# EAGLE design video (EAGLE 7.1.0)
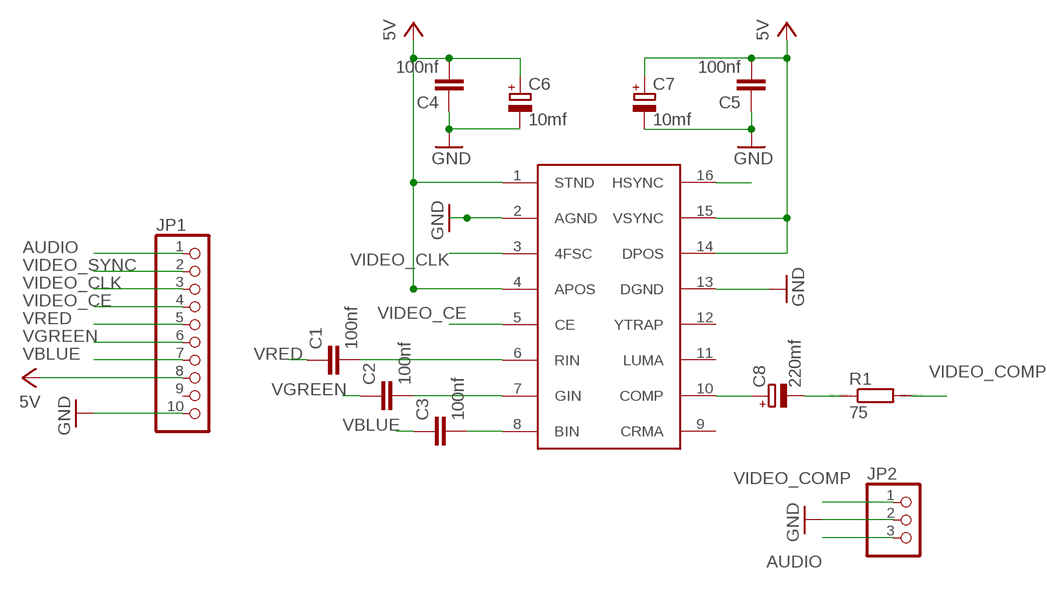
[diagram p0: schematic, sheet 1]

## Parts
C1  100nf  C-EUC0805  [C0805]
C2  100nf  C-EUC0805  [C0805]
C3  100nf  C-EUC0805  [C0805]
C4  100nf  C-EUC0805  [C0805]
C5  100nf  C-EUC0805  [C0805]
C6  10mf  CPOL-EUE1.8-4  [E1,8-4]
C7  10mf  CPOL-EUE1.8-4  [E1,8-4]
C8  220mf  CPOL-EUE1.8-4  [E1,8-4]
JP1  PINHD-1X10  [1X10]
JP2  PINHD-1X3  [1X03]
R1  75  R-EU_R0805  [R0805]
U$1  AD725  [SO16W]

## Nets
AUDIO: JP1.1 JP2.3
GND: C4.1 C5.1 C6.- C7.- JP1.10 JP2.2 U$1.2(AGND) U$1.13(DGND)
N$1: C1.2 U$1.6(RIN)
N$2: C2.2 U$1.7(GIN)
N$3: C3.2 U$1.8(BIN)
N$4: C8.+ U$1.10(COMP)
N$5: C8.- R1.1
VBLUE: C3.1 JP1.7
VCC: C4.2 C5.2 C6.+ C7.+ JP1.8 U$1.1(STND) U$1.4(APOS) U$1.14(DPOS) U$1.15(VSYNC) ; supply symbol labelled 5V
VGREEN: C2.1 JP1.6
VIDEO_CE: JP1.4 U$1.5(CE)
VIDEO_CLK: JP1.3 U$1.3(4FSC)
VIDEO_COMP: JP2.1 R1.2
VIDEO_SYNC: JP1.2 U$1.16(HSYNC)
VRED: C1.1 JP1.5
Unconnected: JP1.9 U$1.9(CRMA) U$1.11(LUMA) U$1.12(YTRAP)

## Library data of the parts
C1-C5 = rcl:C-EU: CAPACITOR, European symbol
C6-C8 = rcl:CPOL-EU: POLARIZED CAPACITOR, European symbol
JP1 = pinhead:PINHD-1X10: PIN HEADER
JP2 = pinhead:PINHD-1X3: PIN HEADER
R1 = resistor:R-EU_: RESISTOR, European symbol; SPICEPREFIX: R
U$1 = ad725:AD725

## Board
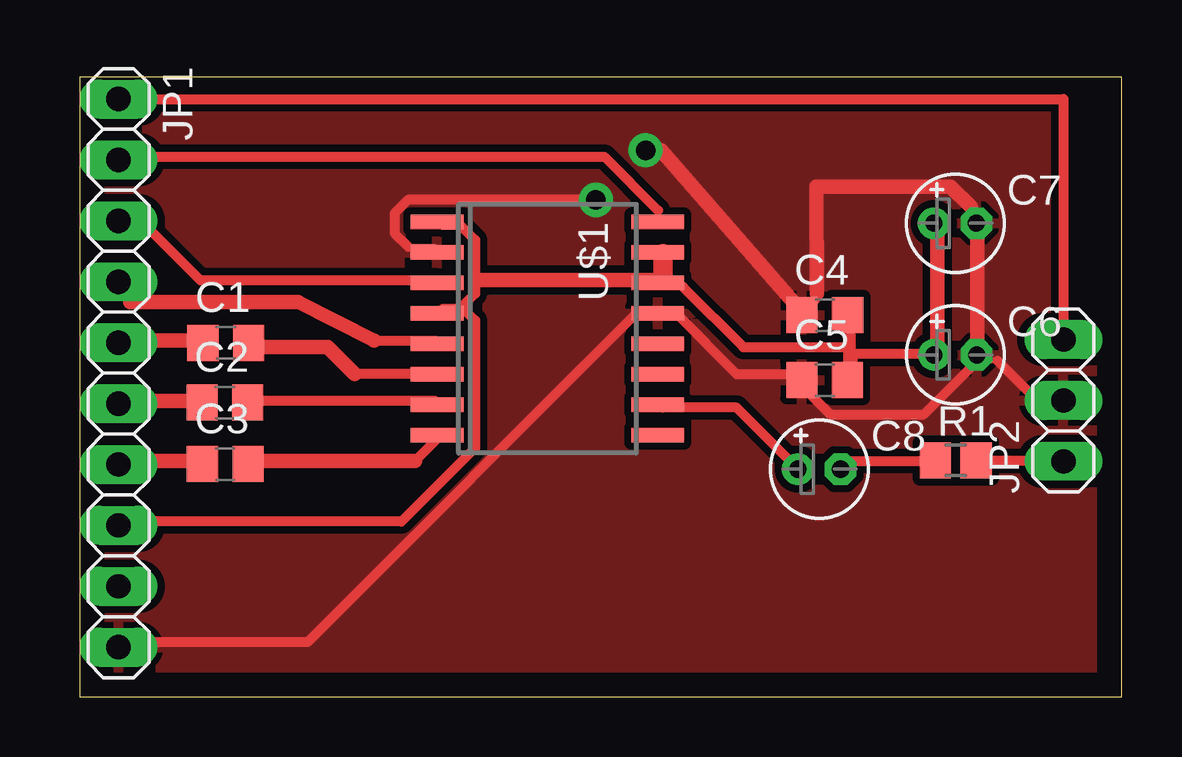
[diagram p1: board, top side]
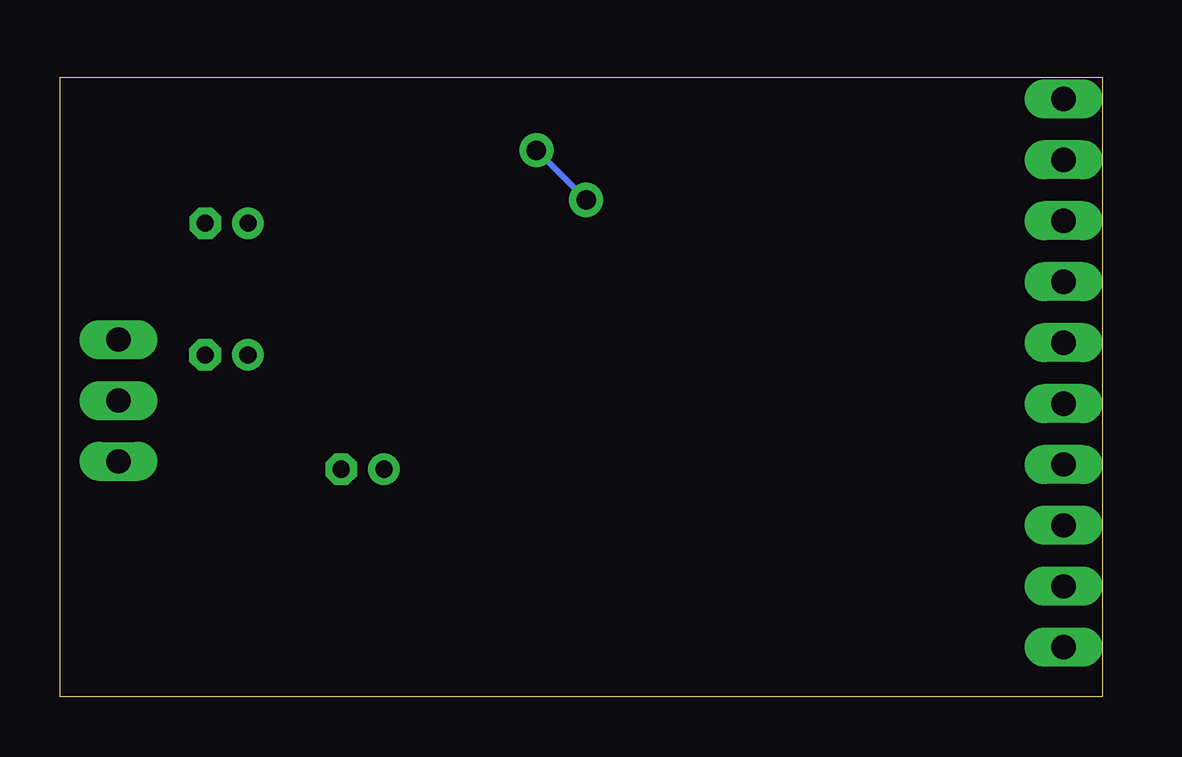
[diagram p2: board, bottom side, seen from below]

Size 43.44 x 25.84 mm. Coordinates in mm from the lower left corner, seen from the top.
Outline: 0,0 43.44,0 43.44,25.84 0,25.84 0,0
Copper layers (1*16): Top 0.035mm / dielectric 1.5mm / Bottom 0.035mm
Design rules "default *": minimum track width 10mil, minimum drill 32mil, track to track 12mil, track to pad 12mil, pad to pad 8mil, via to via 12mil, smd to smd 8mil, copper to edge 40mil, drill to drill 40mil, minimum pad ring 12mil, minimum via ring 12mil, stop-mask expansion 4mil, vias tented up to drill 0mil, thermal gap 10mil

### Footprints (pad centres in the part's own frame; a part is rotated, then mirrored left to right if it is on the bottom)
C0805 = smd 1.3 x 1.5: 1 -0.95,0; 2 0.95,0
E1,8-4 = drill 0.711 pad 1.168: + -0.889,0 | drill 0.711 pad 1.168 octagon: - 0.889,0
1X10 = drill 1.016 long: 1 -11.43,0; 2 -8.89,0; 3 -6.35,0; 4 -3.81,0; 5 -1.27,0; 6 1.27,0; 7 3.81,0; 8 6.35,0; 9 8.89,0; 10 11.43,0
1X03 = drill 1.016 long: 1 -2.54,0; 2 0,0; 3 2.54,0
R0805 = smd 1.3 x 1.5: 1 -0.85,0; 2 0.85,0
SO16W = smd 0.6 x 2.2: 1 -4.445,-4.6; 2 -3.175,-4.6; 3 -1.905,-4.6; 4 -0.635,-4.6; 5 0.635,-4.6; 6 1.905,-4.6; 7 3.175,-4.6; 8 4.445,-4.6; 9 4.445,4.6; 10 3.175,4.6; 11 1.905,4.6; 12 0.635,4.6; 13 -0.635,4.6; 14 -1.905,4.6; 15 -3.175,4.6; 16 -4.445,4.6

### Placement (x,y rotation side)
C1  6.09,14.76 0 top
C2  6.05,12.27 0 top
C3  6.07,9.71 0 top
C4  31.06,15.91 0 top
C5  31.05,13.21 0 top
C6  36.5,14.26 0 top
C7  36.49,19.75 0 top
C8  30.83,9.49 0 top
JP1  1.62,13.5 270 top
JP2  41,12.36 90 top
R1  36.51,9.86 0 top
U$1  19.49,15.35 270 top

### Tracks (layer width: path | path; a pad name or v marks a point on that pad's centre or on a via)
AUDIO
  Top 0.406: JP1.1 41,24.93 JP2.3
GND  (via drill 0.81)
  Top 0.254: 38.25,14.02 37.42,14.02 C6.- | 39.65,12.62 40.77,12.62 JP2.2 | 30.73,16.81 30.73,16.53 30.18,15.97 C4.1 | 37.14,20.44 37.14,19.89 C7.- 37.42,19.61 | 13.69,18.77 14.81,18.77 U$1.2 | 24.22,22.79 v23.58,22.79 | 37.42,14.3 C6.- | 24.87,15.97 24.31,15.97 U$1.13 24.03,15.97 23.19,15.97 | 29.9,13.46 C5.1 29.9,13.18 | 1.68,2.28 JP1.10 | 37.14,13.74 37.14,14.02 C6.-
  Top 0.406: 39.65,12.62 38.25,14.02 | 13.69,18.77 13.13,19.33 13.13,20.16 13.69,20.72 v21.51,20.72 | 29.9,13.46 27.38,13.46 24.87,15.97 | 1.68,2.28 9.5,2.28 23.19,15.97 | 37.14,13.74 35.18,11.78 31.29,11.78 29.9,13.18
  Top 0.61: 30.73,16.81 30.71,21.28 36.3,21.28 37.14,20.44 | 30.18,15.97 24.22,22.79 | 37.42,19.61 37.42,14.3
  Bottom 0.254: v23.58,22.79 v21.51,20.72
  pour Top: 43.25,25.71 0.04,25.71 0.04,0 43.29,0 43.29,25.71
N$1
  Top 0.254: 7.26,14.58 C1.2 | 14.81,13.46 U$1.6
  Top 0.406: 14.81,13.46 11.46,13.46
  Top 0.61: 7.26,14.58 10.34,14.58 11.46,13.46
N$2
  Top 0.254: 7.26,12.34 C2.2 | 14.81,12.34 U$1.7
  Top 0.406: 14.81,12.34 7.26,12.34
N$3
  Top 0.254: 7.26,9.83 C3.2 | 14.81,10.67 U$1.8
  Top 0.406: 14.81,10.67 13.97,9.83
  Top 0.61: 13.97,9.83 7.26,9.83
N$4
  Top 0.254: 24.31,12.06 U$1.10 | 29.9,9.55 C8.+
  Top 0.406: 24.31,12.06 27.38,12.06 29.9,9.55
N$5
  Top 0.254: 32.13,9.83 31.85,9.55 C8.- | 35.46,9.83 R1.1
  Top 0.406: 32.13,9.83 35.46,9.83
VBLUE
  Top 0.254: 5.03,9.83 C3.1 | 1.68,9.83 JP1.7
  Top 0.61: 1.68,9.83 5.03,9.83
VCC
  Top 0.254: 32.13,14.58 32.13,14.3 | 32.13,13.46 C5.2 | 32.13,15.69 C4.2 | 35.46,14.3 C6.+ 35.74,14.3 | 35.74,19.61 C7.+ | 24.31,17.37 U$1.14 | 24.31,18.49 U$1.15 | 15.93,19.61 15.09,19.61 U$1.1 | 24.03,17.37 U$1.14 | 1.68,7.31 JP1.8 | 25.15,17.09 24.31,17.09 U$1.14 | 15.93,16.25 15.09,16.25 U$1.4 15.93,16.25
  Top 0.406: 32.13,15.69 32.13,14.58 27.66,14.58 25.15,17.09 | 35.46,14.3 32.13,14.3 | 15.93,19.61 16.48,19.05 16.48,17.37 16.48,16.81 15.93,16.25 16.48,15.69 16.48,10.39 13.41,7.31 1.68,7.31
  Top 0.61: 32.13,14.3 32.13,13.46 | 35.74,14.3 35.74,19.61 | 16.48,17.37 24.03,17.37
  Top 0.813: 24.31,18.49 24.31,17.37
VGREEN
  Top 0.254: 5.03,12.34 C2.1 | 1.68,12.34 JP1.6
  Top 0.61: 1.68,12.34 5.03,12.34
VIDEO_CE
  Top 0.254: 2.11,16.46 1.68,17.09 JP1.4 | 14.81,14.86 U$1.5
  Top 0.406: 12.28,14.86 14.81,14.86
  Top 0.61: 12.28,14.86 9.1,16.46 2.11,16.46
VIDEO_CLK
  Top 0.254: 2.79,19.61 1.68,19.61 JP1.3 | 14.81,17.37 U$1.3
  Top 0.406: 14.81,17.37 5.03,17.37 2.79,19.61
VIDEO_COMP
  Top 0.254: 37.42,9.83 R1.2 | 40.77,9.83 JP2.1
  Top 0.406: 40.77,9.83 37.42,9.83
VIDEO_SYNC
  Top 0.254: 24.11,20.28 U$1.16 | 1.75,22.52 JP1.2
  Top 0.406: 24.11,20.28 21.87,22.52 1.75,22.52
VRED
  Top 0.254: 5.03,14.86 C1.1 | 1.68,14.86 JP1.5
  Top 0.61: 1.68,14.86 5.03,14.86